# Altium schematic sheet Motor Power Switch.SchDoc
size A4; Organization: TESLA Motors, INC; Address1: 3500 Deer Creek Road; Address2: Palo Alto, CA; Address4: U.S.A.; SheetNumber: 4; SheetTotal: 13
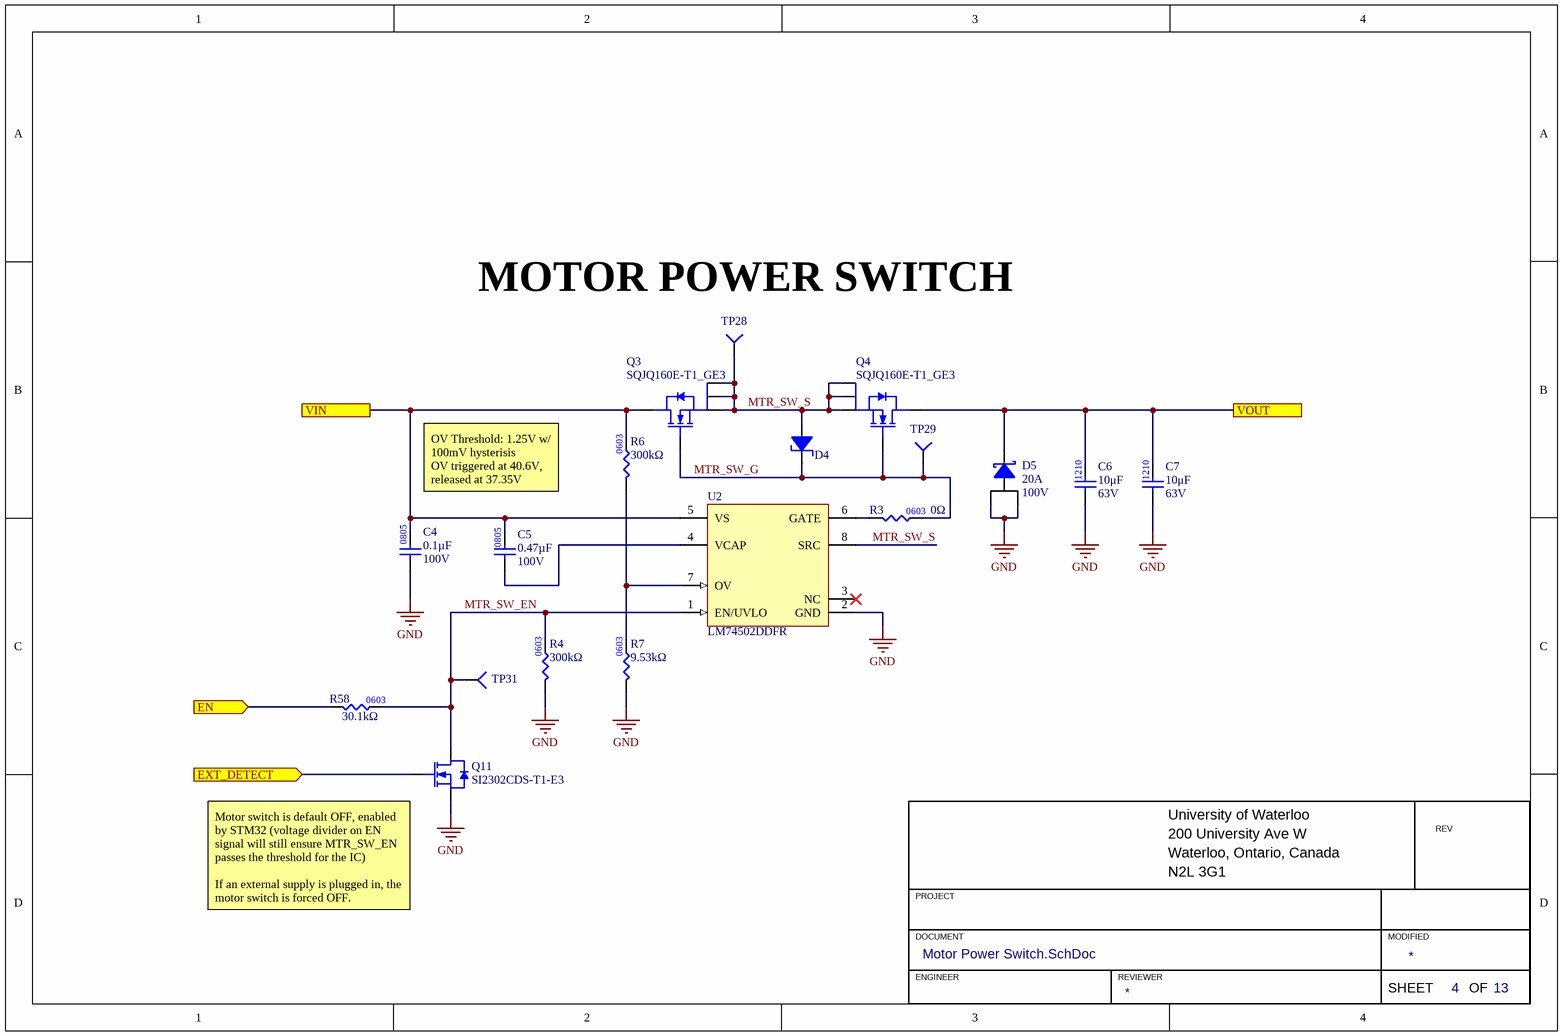
[diagram p0: Motor Power Switch.SchDoc]

## Parts
C4  value 0.1µF  Voltage Rating: 100V  [CAP0805]  (hidden comment: CAP_0.1uF_100V_0805)
C5  value 0.47µF  Voltage Rating: 100V  [CAP0805]  (hidden comment: CAP_0.47uF_100V_0805)
C6  value 10μF  Voltage Rating: 63V  [CAP1210]  (hidden comment: CAP_10uF_63V_1210)
C7  value 10μF  Voltage Rating: 63V  [CAP1210]  (hidden comment: CAP_10uF_63V_1210)
D4  DIO_ZENER_16V  [SOD-123_FLAT]  (value not drawn)
D5  Current - Average Rectified (Io): 20A  Vr (Max): 100V  [D-PAK]  (hidden comment: DIO_SCHOTTKY_100V_20A)
Q3  Manufacturer Part Number 1: SQJQ160E-T1_GE3  [VISHAY_PowerPAK-8x8]  (hidden comment: NMOS_60V_603A)
Q4  Manufacturer Part Number 1: SQJQ160E-T1_GE3  [VISHAY_PowerPAK-8x8]  (hidden comment: NMOS_60V_603A)
Q11  Manufacturer Part Number 1: SI2302CDS-T1-E3  [SOT23-3]  (hidden comment: NMOS_20V_6A)
R3  value 0Ω  [RES0603]  (hidden comment: RES_0Ω_0603)
R4  value 300kΩ  [RES0603]  (hidden comment: RES_300kΩ_0603_1%)
R6  value 300kΩ  [RES0603]  (hidden comment: RES_300kΩ_0603_1%)
R7  value 9.53kΩ  [RES0603]  (hidden comment: RES_9.53kΩ_0603_1%)
R58  value 30.1kΩ  [RES0603]  (hidden comment: RES_30.1kΩ_0603_1%)
TP28  TESTPOINT_1MM_SQUARE  [TESTPOINT_SQUARE_1MM]  (value not drawn)  (no BOM)
TP29  TESTPOINT_1MM_CIRCLE  [TESTPOINT_CIRCLE_1MM]  (value not drawn)  (no BOM)
TP31  TESTPOINT_1MM_CIRCLE  [TESTPOINT_CIRCLE_1MM]  (value not drawn)  (no BOM)
U2  LM74502DDFR  [TI_SOT23-8]

## Ports
EN (in), EXT_DETECT (in), VIN, VOUT

## Nets
GND: C4.1 C6.1 C7.1 D5.2(Anode) D5.3(Anode) Q11.2(SOURCE) R4.1 R7.1 U2.2(GND)
EN: R58.1 ; port EN
EXT_DETECT: Q11.1(GATE) ; port EXT_DETECT
MTR_SW_EN: Q11.3(DRAIN) R4.2 R58.2 TP31.1(=value) U2.1(EN/UVLO)
MTR_SW_G: D4.2(Cathode) Q3.1(Gate) Q4.1(Gate) R3.2 TP29.1(=value)
MTR_SW_S: D4.1(Anode) Q3.2(Source) Q3.3(Source) Q3.4(Source) Q4.2(Source) Q4.3(Source) Q4.4(Source) TP28.1(=value) U2.8(SRC)
VIN: C4.2 C5.2 Q3.5(Drain) R6.2 U2.5(VS) ; port VIN
VOUT: C6.2 C7.2 D5.1(Cathode) Q4.5(Drain) ; port VOUT
NetC5_1: C5.1 U2.4(VCAP)
NetR3_1: R3.1 U2.6(GATE)
NetR6_1: R6.1 R7.2 U2.7(OV)

Not connected (* = marked no-connect by the designer): U2 3(NC)*

## Notes on the sheet
- (near TP28) MOTOR POWER SWITCH
- OV Threshold: 1.25V w/ 100mV hysterisis
  OV triggered at 40.6V, released at 37.35V
- University of Waterloo
- 200 University Ave W
- REV
- (near Q11) Motor switch is default OFF, enabled by STM32 (voltage divider on EN signal will still ensure MTR_SW_EN passes the threshold for the IC)
  If an external supply is plugged in, the motor switch is forced OFF.
- PROJECT
- Waterloo, Ontario, Canada
- N2L 3G1
- DOCUMENT
- ENGINEER
- REVIEWER
- MODIFIED
- SHEET
- OF

## Library data of the parts
C4 = CAP_0.1uF_100V_0805: CAP CER 0.1UF 100V X7R 0805; Manufacturer 1: TDK Corporation; Manufacturer Part Number 1: C2012X7R2A104K125AA; Package: 0805; Supplier 1: Digi-Key; Supplier Part Number 1: 445-1418-1-ND
C5 = CAP_0.47uF_100V_0805: CAP CER 0.47UF 100V X7R 0805; Manufacturer 1: YAGEO; Manufacturer Part Number 1: CC0805KKX7R0BB474; Package: 0805; Supplier 1: Digikey; Supplier Part Number 1: 13-CC0805KKX7R0BB474DKR-ND
C6 C7 = CAP_10uF_63V_1210: CAP CER 10UF 63V X7R 1210; Manufacturer 1: Samsung Electro-Mechanics; Manufacturer Part Number 1: CL32B106KMVNNWE; Mounting Type: SMD; Package: 1210; Dielectric: X7R; Supplier 1: Digikey; Supplier Part Number 1: 1276-7053-6-ND
D4 = DIO_ZENER_16V: DIODE ZENER 16V 500MW SOD123; Manufacturer Part Number 1: DDZ9703-7; Manufacturer 1: Diodes Incorporated; Forward Voltage: 900mV; Supplier 1: Digi-Key; Supplier Part Number 1: DDZ9703-7DICT-ND
D5 = DIO_SCHOTTKY_100V_20A: 100V, 20A, DPAK, DIODE SCHOTTKY; Manufacturer 1: SMC Diode Solutions; Manufacturer Part Number 1: MBRD20100; Mounting Type: SMD; Package/Footprint: DPAK; Supplier 1: Digikey; Supplier Part Number 1: 1655-MBRD20100CTDKR-ND
Q3 Q4 = NMOS_60V_603A: AUTOMOTIVE N-CHANNEL 60 V (D-S); Manufacturer 1: Vishay Siliconix; Vdss: 60V; Vgs (Max): 20V; Power Dissipation (Max): 600W; Id: 603A; Supplier 1: Digi-Key; Supplier Part Number 1: 742-SQJQ160E-T1_GE3CT-ND; FET Type: N-Channel; Supplier Device Package: PowerPak 8x8
Q11 = NMOS_20V_2.6A: MOSFET N-CH 20V 2.6A SOT23-3; Manufacturer 1: Vishay Siliconix; Package/Footprint: SOT-23-3; Supplier 1: Digi-Key; Supplier Part Number 1: SI2302CDS-T1-E3CT-ND
R3 = RES_0Ω_0603: RES 0 OHM JUMPER 1/10W 0603; Manufacturer 1: Yageo; Manufacturer Part Number 1: RC0603JR-070RL; Supplier Part Number 1: 311-0.0GRCT-ND; Supplier 1: Digi-Key; Mounting Type: SMD; Package: 0603
R4 R6 = RES_300kΩ_0603_1%: RES 300K OHM 1% 1/10W 0603; Manufacturer 1: Stackpole Electronics Inc; Manufacturer Part Number 1: RMCF0603FT300K; Supplier Part Number 1: RMCF0603FT300KCT-ND; Supplier 1: Digi-Key; Package: 0603; Tolerance: 1%
R7 = RES_9.53kΩ_0603_1%: RES 9.53K OHM 1% 1/10W 0603; Manufacturer 1: Stackpole Electronics Inc; Manufacturer Part Number 1: RC0603FR-079K53L; Supplier Part Number 1: 311-9.53KHRCT-ND; Supplier 1: Digi-Key; Mounting Type: SMD; Package: 0603
R58 = RES_30.1kΩ_0603_1%: RES 30.1K OHM 1% 1/10W 0603; Manufacturer 1: Panasonic Electronic Components; Manufacturer Part Number 1: ERJ-3EKF3012V; Mounting Type: SMD; Package: 0603; Supplier 1: Digikey; Supplier Part Number 1: P30.1KHCT-ND
TP28 = TESTPOINT_1MM_SQUARE: TESTPOINT 1MM SQUARE
TP29 TP31 = TESTPOINT_1MM_CIRCLE: TESTPOINT 1MM CIRCLE
U2 = LM74502DDFR: 3.2-V TO 65-V INDUSTRIAL RPP CON; Manufacturer 1: Texas Instruments; Package/Footprint: SOT-23; Manufacturer Part Number 1: LM74502DDFR; Supplier 1: Digikey; Supplier Part Number 1: 296-LM74502DDFRCT-ND